# EasyEDA schematic SCH_Airliner_radio.json
TITLE: Generic airliner radio panel; REV: 1.0; Date: 2021-07-26; Sheet: 1/1; Drawn By: Tuomas Kuosmanen; Company: Your Company
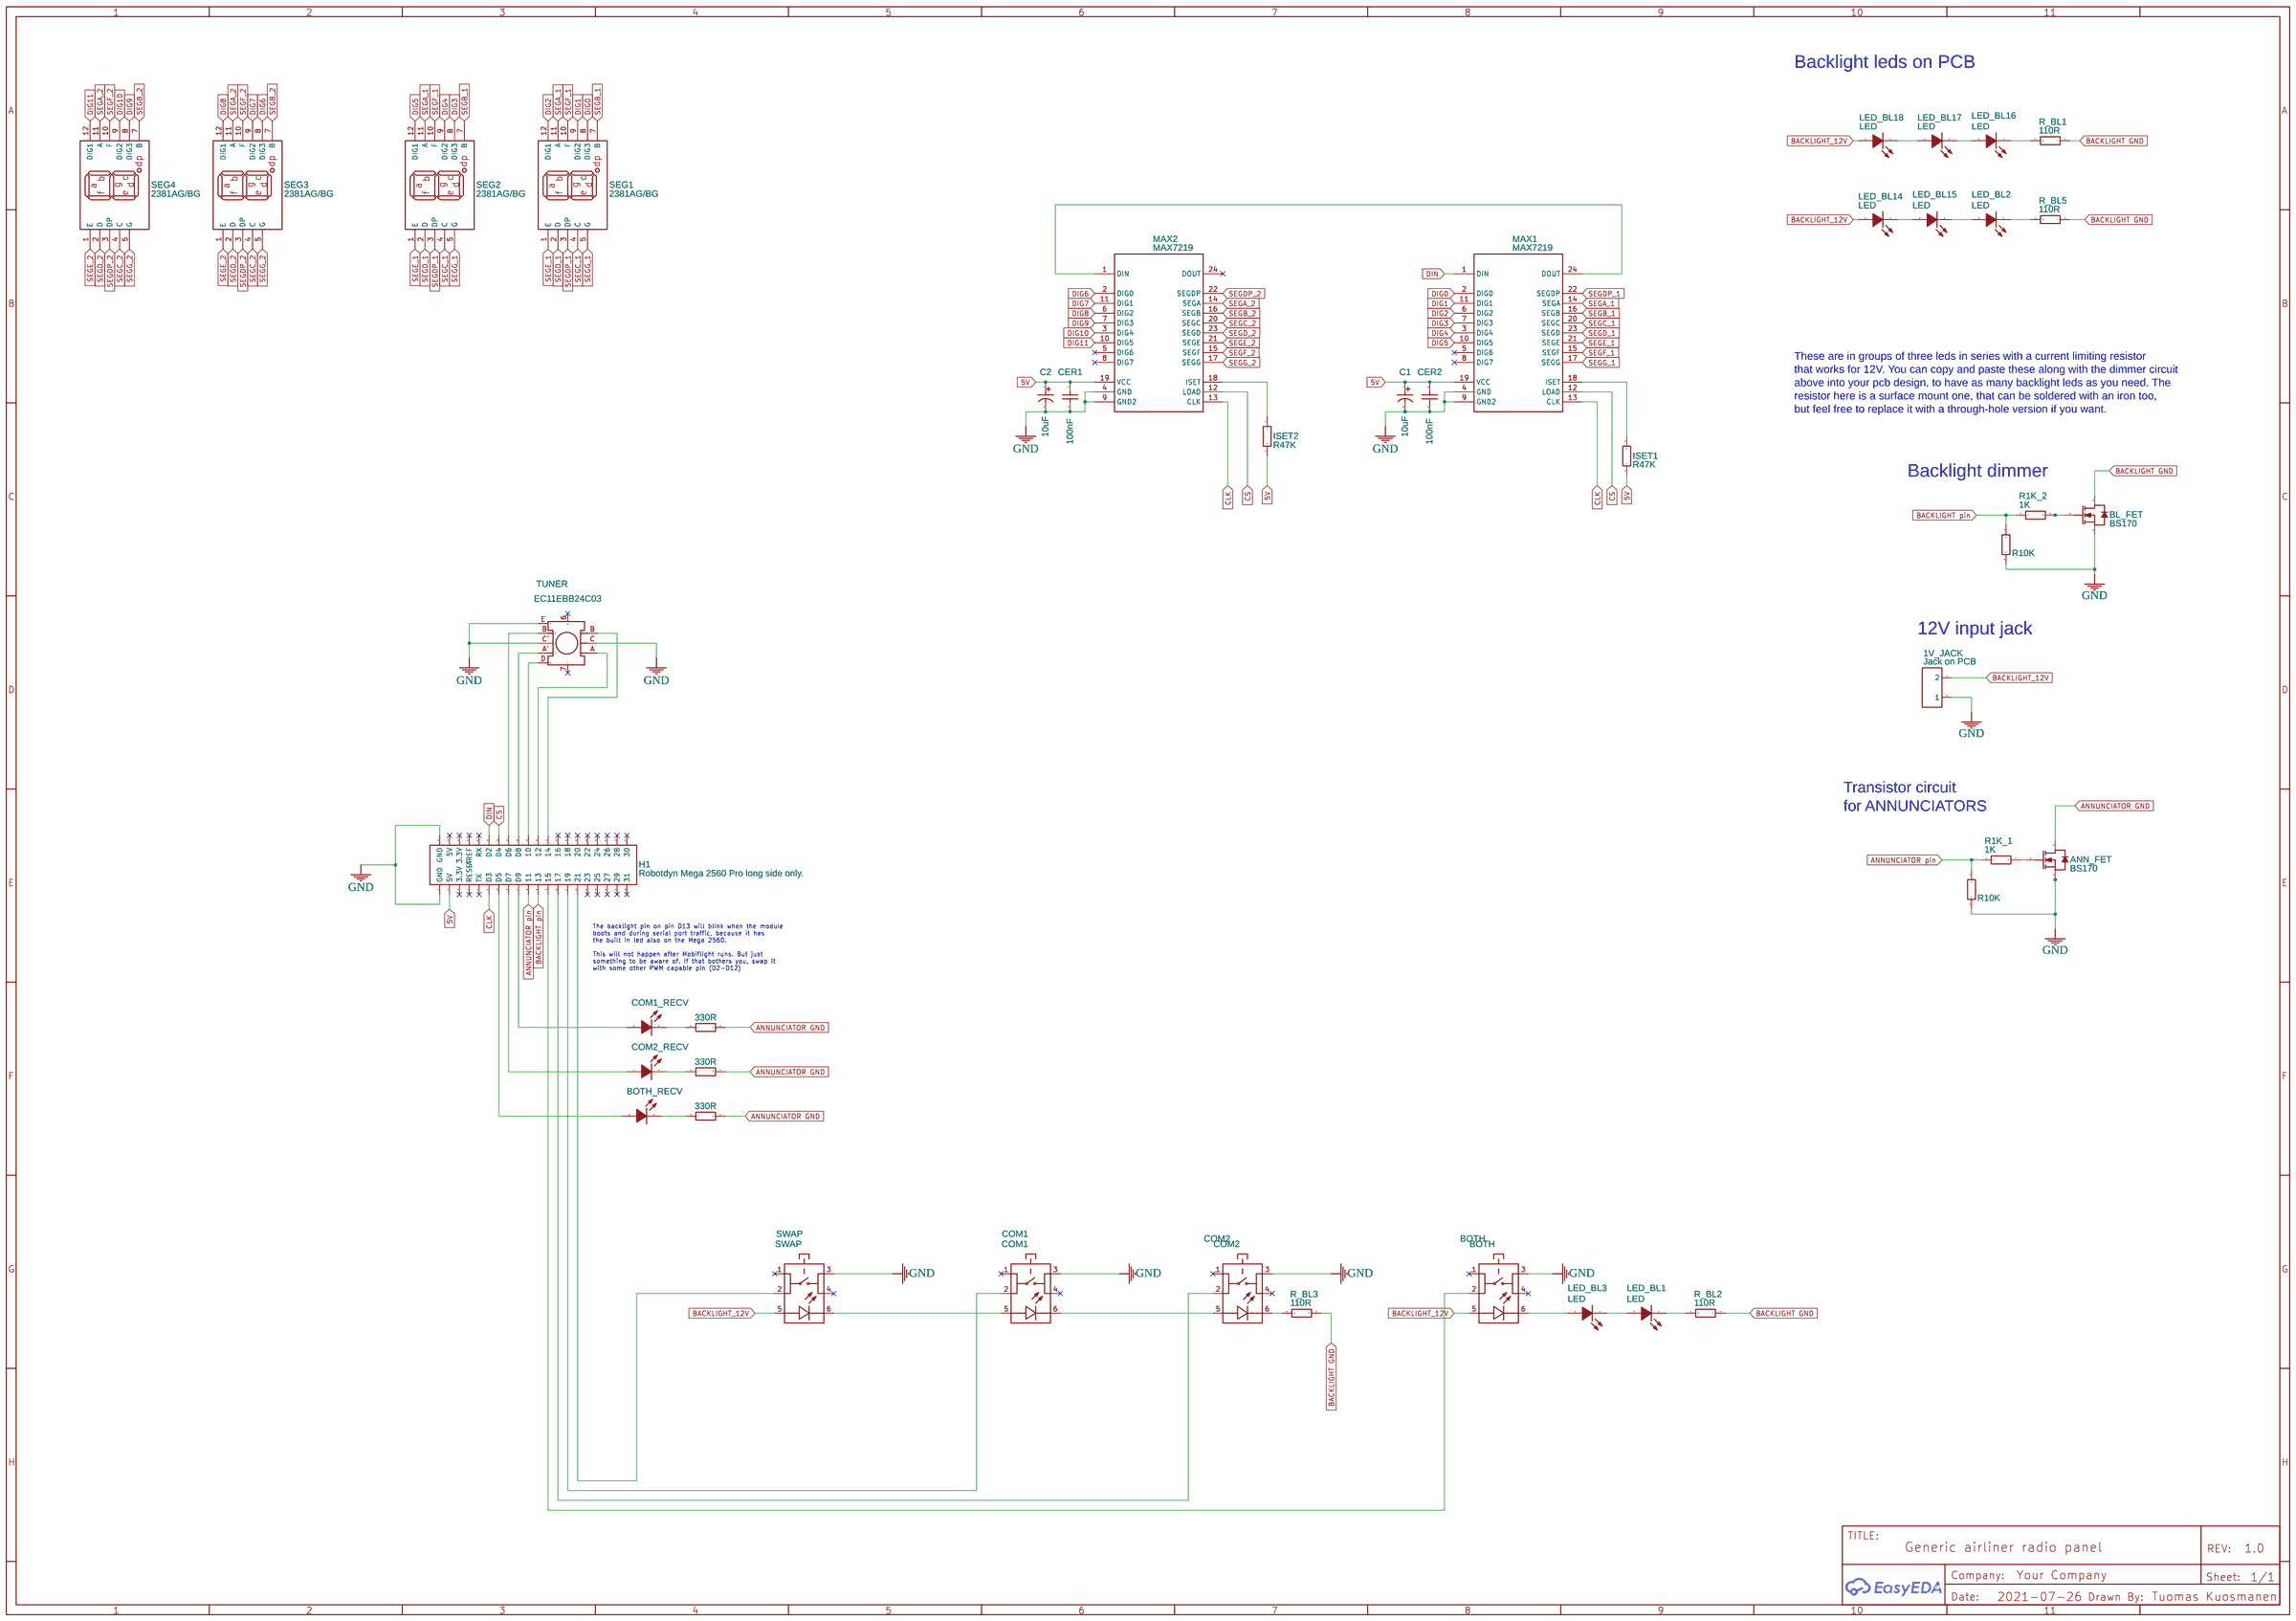
[diagram p0: schematic sheet]

## Parts
1_SURFACE_MOUNT_RESISTOR  330R  [R1206]
1MM_LED_THROUGH_HOLE  COM2_RECV  [LED-TH_BD3.8-P2.54-FD]
1V_JACK  Jack on PCB  [JACK ON PCB]
2_SURFACE_MOUNT_RESISTOR  330R  [R1206]
2MM_LED_THROUGH_HOLE  BOTH_RECV  [LED-TH_BD3.8-P2.54-FD]
3_SURFACE_MOUNT_RESISTOR  330R  [R1206]
5MM_LED_THROUGH_HOLE  COM1_RECV  [LED-TH_BD3.8-P2.54-FD]
ANN_FET  BS170  [TO-92-3_L4.9-W3.7-P1.27-L]
BL_FET  BS170  [TO-92-3_L4.9-W3.7-P1.27-L]
BOTH  BOTH  [MULTIMEC 3FTH980 - KEY SWITCH, 50 MA, 24 VDC, MEC]
C1  10uF  [CAP-TH_BD6.3-P2.50-D1.0-FD]
C2  10uF  [CAP-TH_BD6.3-P2.50-D1.0-FD]
CER1  100nF  [CAP-TH_L5.0-W2.5-P2.54-D0.7]
CER2  100nF  [CAP-TH_L5.0-W2.5-P2.54-D0.7]
COM1  COM1  [MULTIMEC 3FTH980 - KEY SWITCH, 50 MA, 24 VDC, MEC]
COM2  COM2  [MULTIMEC 3FTH980 - KEY SWITCH, 50 MA, 24 VDC, MEC]
H1  Robotdyn Mega 2560 Pro long side only.  [HDR-TH_40P-P2.54-V-M-R2-C20-S2.54]
ISET1  R47K  [R1206]
ISET2  R47K  [R1206]
LED_BL1  LED  [LED1206-RD]
LED_BL2  LED  [LED1206-RD]
LED_BL3  LED  [LED1206-RD]
LED_BL14  LED  [LED1206-RD]
LED_BL15  LED  [LED1206-RD]
LED_BL16  LED  [LED1206-RD]
LED_BL17  LED  [LED1206-RD]
LED_BL18  LED  [LED1206-RD]
MAX1  MAX7219  [DIP24]
MAX2  MAX7219  [DIP24]
R1K_1  1K  [R1206]
R1K_2  1K  [R1206]
R_ANN1  R10K  [R1206]
R_ANN5  R10K  [R1206]
R_BL1  110R  [R1206]
R_BL2  110R  [R1206]
R_BL3  110R  [R1206]
R_BL5  110R  [R1206]
SEG1  2381AG/BG  [LED-SEG-TH_FJ2381AH]
SEG2  2381AG/BG  [LED-SEG-TH_FJ2381AH]
SEG3  2381AG/BG  [LED-SEG-TH_FJ2381AH]
SEG4  2381AG/BG  [LED-SEG-TH_FJ2381AH]
SWAP  SWAP  [MULTIMEC 3FTH980 - KEY SWITCH, 50 MA, 24 VDC, MEC]
TUNER  EC11EBB24C03  [SW-TH_EC11EBB24C03]

## Library data of the parts
1_SURFACE_MOUNT_RESISTOR 2_SURFACE_MOUNT_RESISTOR 3_SURFACE_MOUNT_RESISTOR = 1206W4F330LT5E: Supplier: LCSC; Manufacturer: UniOhm; Supplier Part: C25337; JLCPCB Part Class: Extended Part
1MM_LED_THROUGH_HOLE 2MM_LED_THROUGH_HOLE 5MM_LED_THROUGH_HOLE = LEDOrange orange 3AO4UD: Supplier: LCSC; Manufacturer: KENTO; Supplier Part: C62095
1V_JACK = J-Header-Male-2.54_1x2: Manufacturer: TE Connectivity; image: //image.lceda.cn/szlcsc/C86471.jpg; link: //image.lceda.cn/szlcsc/C86471.jpg; Package Display: No
ANN_FET BL_FET = BS170: Supplier: LCSC; Manufacturer: FAIRCHILD; Supplier Part: C111691; JLCPCB Part Class: Extended Part
BOTH COM1 COM2 SWAP = MULTIMEC 3FTH980 - Key Switch, 50 mA, 24 VDC, MEC: Manufacturer Part: 1052612; link: https://www.elfadistrelec.no/Web/Downloads/he/et/3A3F4F_eng_datasheet.pdf; Contributor: smund3
C1 C2 = 10uf/100V: Supplier: LCSC; Manufacturer: ValuePro; Supplier Part: C2029; JLCPCB Part Class: Extended Part
CER1 CER2 = CS1F5.6Y5V1A104Z: Supplier: LCSC; Manufacturer: ReliaPro; Supplier Part: C9306
H1 = Header-Male-2.54_2x20: Supplier: LCSC; Manufacturer: ReliaPro; Supplier Part: C50980; JLCPCB Part Class: Extended Part
ISET1 ISET2 R1K_1 R1K_2 R_ANN1 R_ANN5 R_BL1-R_BL3 R_BL5 = 1206W4J0331T5E: Supplier: LCSC; Manufacturer: UniOhm; Supplier Part: C25374
LED_BL1-LED_BL3 LED_BL14-LED_BL18 = HQ17-2102UYOC: Supplier: LCSC; Manufacturer: HARVATEK; Contributor: LCSC; Supplier Part: C154481; JLCPCB Part Class: Extended Part
MAX1 MAX2 = MAX7219: Contributor: Dompie
SEG1-SEG4 = 2381AG/BG: Manufacturer: XLITX Technology
TUNER = EC11EBB24C03: Supplier: LCSC; Supplier Part: C470790; Manufacturer: ALPS Electric; Contributor: LCSC; JLCPCB Part Class: Extended Part

## Nets
5V: C1.1 C2.1 CER1.2 CER2.2 H1.3(5V) ISET1.1 ISET2.1 MAX1.19(VCC) MAX2.19(VCC)
GND: 1V_JACK.1 ANN_FET.3(S) BL_FET.3(S) BOTH.3 C1.2 C2.2 CER1.1 CER2.1 COM1.3 COM2.3 H1.1(GND) H1.2(GND) MAX1.4(GND) MAX1.9(GND2) MAX2.4(GND) MAX2.9(GND2) R_ANN1.2 R_ANN5.2 SWAP.3 TUNER.C TUNER.C' TUNER.E
ANNUNCIATOR GND: 1_SURFACE_MOUNT_RESISTOR.2 2_SURFACE_MOUNT_RESISTOR.2 3_SURFACE_MOUNT_RESISTOR.2 ANN_FET.1(D)
ANNUNCIATOR pin: H1.19(11) R1K_1.2 R_ANN1.1
BACKLIGHT GND: BL_FET.1(D) R_BL1.1 R_BL2.1 R_BL3.1 R_BL5.1
BACKLIGHT pin: H1.21(13) R1K_2.2 R_ANN5.1
BACKLIGHT_12V: 1V_JACK.2 BOTH.5(2) LED_BL14.2(A) LED_BL18.2(A) SWAP.5(2)
CLK: H1.11(D3) MAX1.13(CLK) MAX2.13(CLK)
CS: H1.14(D4) MAX1.12(LOAD) MAX2.12(LOAD)
DIG0: MAX1.2(DIG0) SEG1.8(DIG3)
DIG1: MAX1.11(DIG1) SEG1.9(DIG2)
DIG2: MAX1.6(DIG2) SEG1.12(DIG1)
DIG3: MAX1.7(DIG3) SEG2.8(DIG3)
DIG4: MAX1.3(DIG4) SEG2.9(DIG2)
DIG5: MAX1.10(DIG5) SEG2.12(DIG1)
DIG6: MAX2.2(DIG0) SEG3.8(DIG3)
DIG7: MAX2.11(DIG1) SEG3.9(DIG2)
DIG8: MAX2.6(DIG2) SEG3.12(DIG1)
DIG9: MAX2.7(DIG3) SEG4.8(DIG3)
DIG10: MAX2.3(DIG4) SEG4.9(DIG2)
DIG11: MAX2.10(DIG5) SEG4.12(DIG1)
DIN: H1.12(D2) MAX1.1(DIN)
SEGA_1: MAX1.14(SEGA) SEG1.11(A) SEG2.11(A)
SEGA_2: MAX2.14(SEGA) SEG3.11(A) SEG4.11(A)
SEGB_1: MAX1.16(SEGB) SEG1.7(B) SEG2.7(B)
SEGB_2: MAX2.16(SEGB) SEG3.7(B) SEG4.7(B)
SEGC_1: MAX1.20(SEGC) SEG1.4(C) SEG2.4(C)
SEGC_2: MAX2.20(SEGC) SEG3.4(C) SEG4.4(C)
SEGD_1: MAX1.23(SEGD) SEG1.2(D) SEG2.2(D)
SEGD_2: MAX2.23(SEGD) SEG3.2(D) SEG4.2(D)
SEGDP_1: MAX1.22(SEGDP) SEG1.3(DP) SEG2.3(DP)
SEGDP_2: MAX2.22(SEGDP) SEG3.3(DP) SEG4.3(DP)
SEGE_1: MAX1.21(SEGE) SEG1.1(E) SEG2.1(E)
SEGE_2: MAX2.21(SEGE) SEG3.1(E) SEG4.1(E)
SEGF_1: MAX1.15(SEGF) SEG1.10(F) SEG2.10(F)
SEGF_2: MAX2.15(SEGF) SEG3.10(F) SEG4.10(F)
SEGG_1: MAX1.17(SEGG) SEG1.5(G) SEG2.5(G)
SEGG_2: MAX2.17(SEGG) SEG3.5(G) SEG4.5(G)
Net-(1_SURFACE_MOUNT_RESISTOR-1): 1_SURFACE_MOUNT_RESISTOR.1 1MM_LED_THROUGH_HOLE.2(K)
Net-(1MM_LED_THROUGH_HOLE-1): 1MM_LED_THROUGH_HOLE.1(A) H1.15(D7)
Net-(2_SURFACE_MOUNT_RESISTOR-1): 2_SURFACE_MOUNT_RESISTOR.1 5MM_LED_THROUGH_HOLE.2(K)
Net-(2MM_LED_THROUGH_HOLE-1): 2MM_LED_THROUGH_HOLE.1(A) H1.13(D5)
Net-(2MM_LED_THROUGH_HOLE-2): 2MM_LED_THROUGH_HOLE.2(K) 3_SURFACE_MOUNT_RESISTOR.1
Net-(5MM_LED_THROUGH_HOLE-1): 5MM_LED_THROUGH_HOLE.1(A) H1.17(D9)
Net-(ANN_FET-2): ANN_FET.2(G) R1K_1.1
Net-(BL_FET-2): BL_FET.2(G) R1K_2.1
Net-(BOTH-2): BOTH.2 H1.23(15)
Net-(BOTH-6): BOTH.6(4) LED_BL3.2(A)
Net-(COM1-2): COM1.2 H1.27(19)
Net-(COM1-5): COM1.5(2) SWAP.6(4)
Net-(COM1-6): COM1.6(4) COM2.5(2)
Net-(COM2-2): COM2.2 H1.25(17)
Net-(COM2-6): COM2.6(4) R_BL3.2
Net-(H1-16): H1.16(D6) TUNER.B'
Net-(H1-18): H1.18(D8) TUNER.A'
Net-(H1-20): H1.20(10) TUNER.D
Net-(H1-22): H1.22(12) TUNER.A
Net-(H1-24): H1.24(14) TUNER.B
Net-(H1-29): H1.29(21) SWAP.2
Net-(ISET1-2): ISET1.2 MAX1.18(ISET)
Net-(ISET2-2): ISET2.2 MAX2.18(ISET)
Net-(LED_BL1-1): LED_BL1.1(K) R_BL2.2
Net-(LED_BL1-2): LED_BL1.2(A) LED_BL3.1(K)
Net-(LED_BL2-1): LED_BL2.1(K) R_BL5.2
Net-(LED_BL2-2): LED_BL2.2(A) LED_BL15.1(K)
Net-(LED_BL14-1): LED_BL14.1(K) LED_BL15.2(A)
Net-(LED_BL16-1): LED_BL16.1(K) R_BL1.2
Net-(LED_BL16-2): LED_BL16.2(A) LED_BL17.1(K)
Net-(LED_BL17-2): LED_BL17.2(A) LED_BL18.1(K)
Net-(MAX1-24): MAX1.24(DOUT) MAX2.1(DIN)

Not connected (* = marked no-connect by the designer): BOTH 1* 4*; COM1 1* 4*; COM2 1* 4*; H1 4(5V)* 5(3.3V)* 6(3.3V)* 7(RESET)* 8(AREF)* 9(TX)* 10(RX)* 26(16)* 28(18)* 30(20)* 31(23)* 32(22)* 33(25)* 34(24)* 35(27)* 36(26)* 37(29)* 38(28)* 39(31)* 40(30)*; MAX1 5(DIG6)* 8(DIG7)*; MAX2 5(DIG6)* 8(DIG7)* 24(DOUT)*; SWAP 1* 4*; TUNER 6* 7*

## Notes on the sheet
- Backlight leds on PCB
- These are in groups of three leds in series with a current limiting resistor
  that works for 12V. You can copy and paste these along with the dimmer circuit
  above into your pcb design, to have as many backlight leds as you need. The
  resistor here is a surface mount one, that can be soldered with an iron too,
  but feel free to replace it with a through-hole version if you want.
- Backlight dimmer
- 12V input jack
- Transistor circuit
  for ANNUNCIATORS
- The backlight pin on pin D13 will blink when the module
  boots and during serial port traffic, because it has
  the built in led also on the Mega 2560.
  This will not happen after Mobiflight runs. But just
  something to be aware of. If that bothers you, swap it
  with some other PWM capable pin (D2-D12)
